# EAGLE design working (EAGLE 7.6.0)
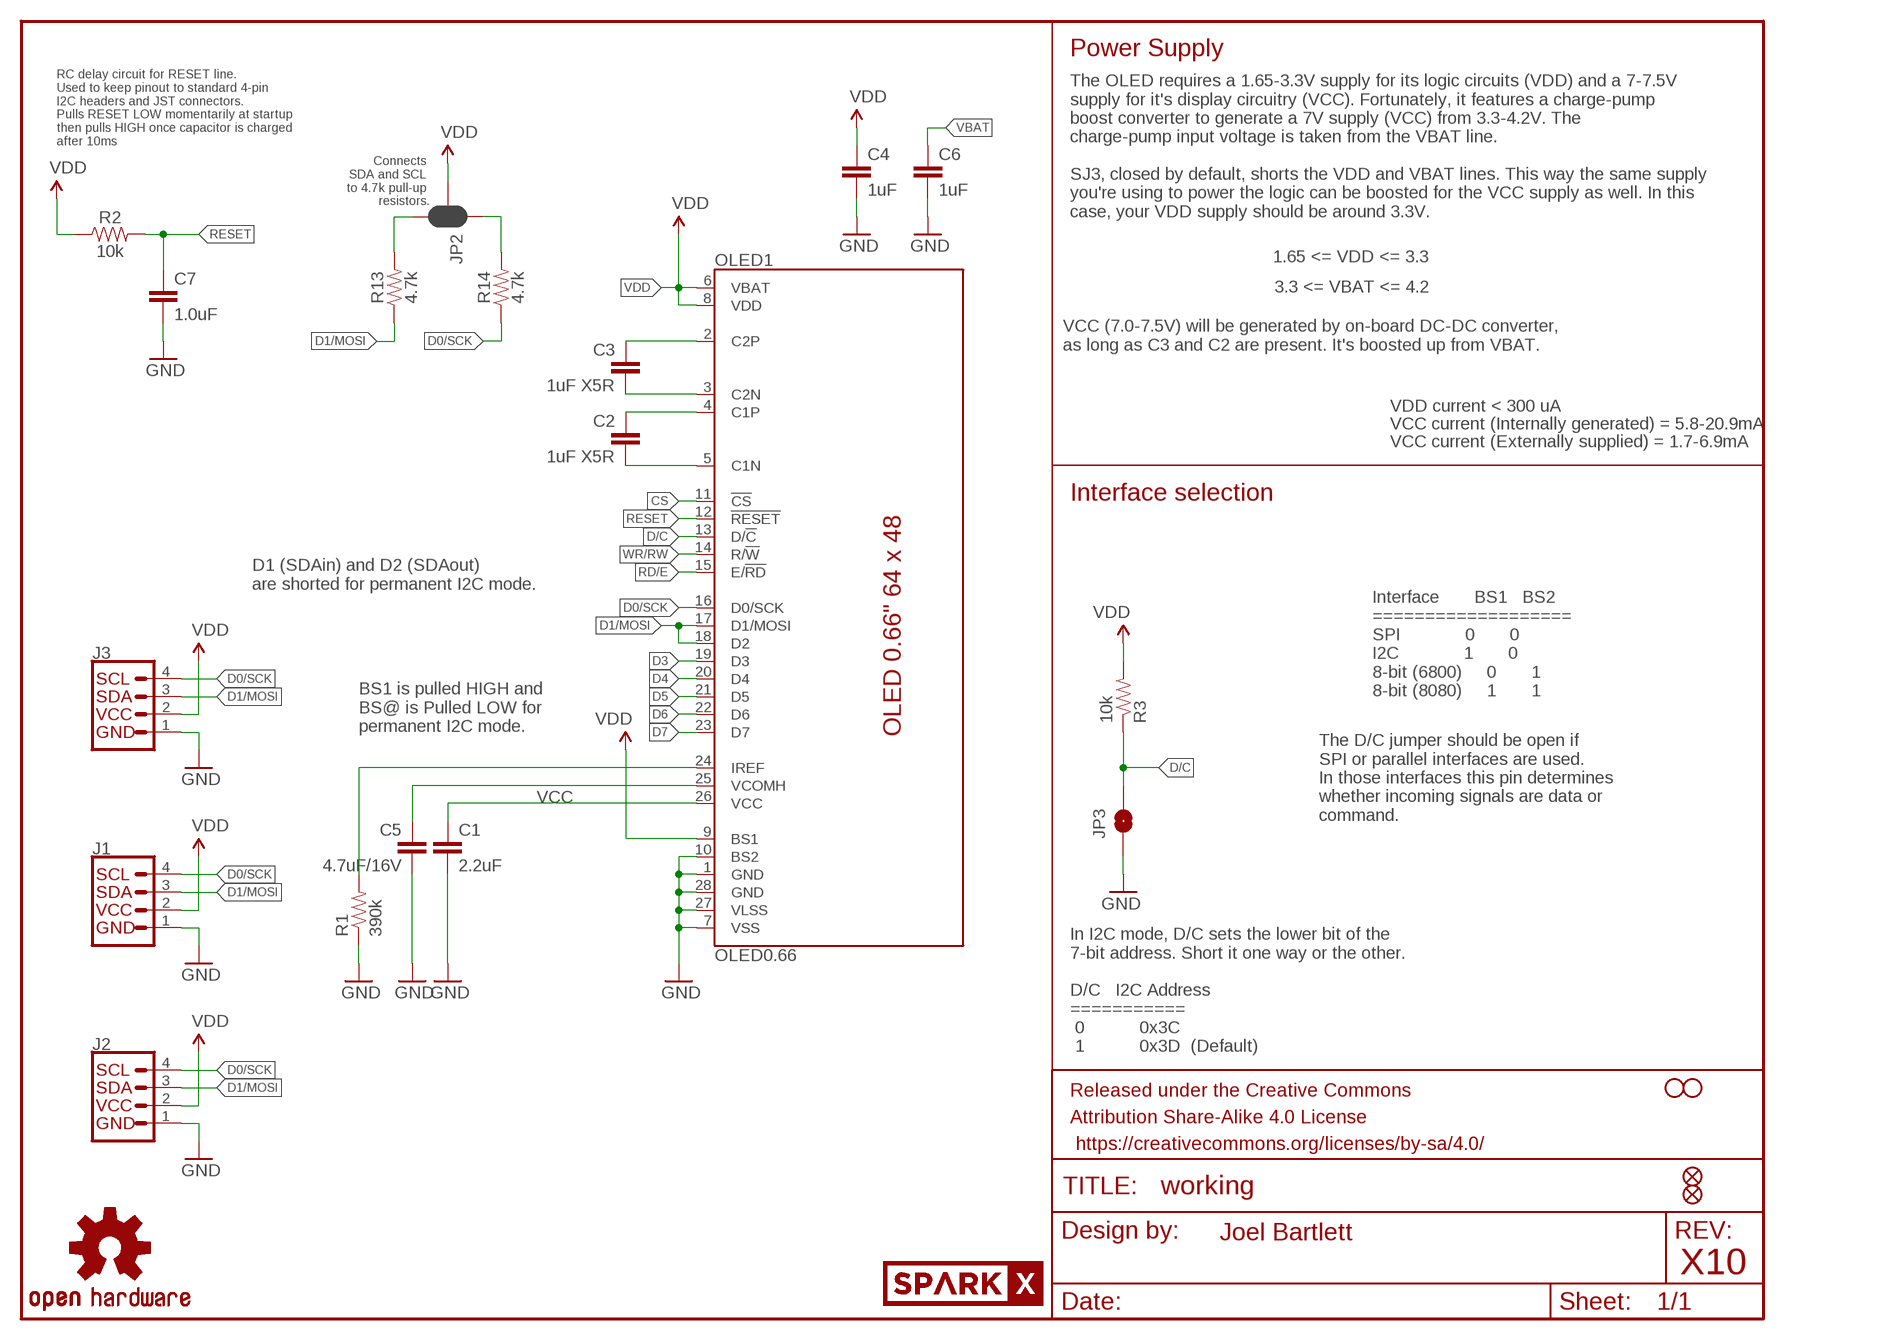
[diagram p0: schematic, sheet 1]

## Parts
C1  2.2uF  CAP0805  [0805]
C2  1uF X5R  CAP0805  [0805]
C3  1uF X5R  CAP0805  [0805]
C4  1uF  CAP0603-CAP  [0603-CAP]
C5  4.7uF/16V  CAP1206  [1206]
C6  1uF  CAP0603-CAP  [0603-CAP]
C7  1.0uF  1.0UF-0603-16V-10%  [0603]
FID1  FIDUCIAL1X2  [FIDUCIAL-1X2]
FID2  FIDUCIAL1X2  [FIDUCIAL-1X2]
FRAME1  FRAME-LETTER  [CREATIVE_COMMONS]
H1  STAND-OFF  [STAND-OFF]
H2  STAND-OFF  [STAND-OFF]
J1  I2C_STANDARDJS-1MM  [1X04_1MM_RA]
J2  I2C_STANDARDJS-1MM  [1X04_1MM_RA]
J3  I2C_STANDARD_NO_SILK  [1X04_NO_SILK]
JP2  JUMPER-SMT_3_2-NC_PASTE_SILK  [SMT-JUMPER_3_2-NC_PASTE_SILK]
JP3  JUMPER-SMT_2_NO_SILK  [SMT-JUMPER_2_NO_SILK]
LOGO3  OSHW-LOGOS  [OSHW-LOGO-S]
OLED1  OLED0.66  [OLED-0.66-64X48]
R1  390k  RESISTOR0603-RES  [0603-RES]
R2  10k  10KOHM-0603-1/10W-1%  [0603]
R3  10k  RESISTOR0603-RES  [0603-RES]
R13  4.7k  4.7KOHM-0603-1/10W-1%  [0603]
R14  4.7k  4.7KOHM-0603-1/10W-1%  [0603]
U$1  SPARKX-LOGO4  [SPARKX-MEDIUM]
U$3  SPARKX-LOGO2  [SPARKX-TINY]

## Nets
C1N: C2.2 OLED1.5(C1N)
C1P: C2.1 OLED1.4(C1P)
C2N: C3.2 OLED1.3(C2N)
C2P: C3.1 OLED1.2(C2P)
CS: OLED1.11(!CS!)
D0/SCK: J1.4(SCL) J2.4(SCL) J3.4(SCL) OLED1.16(D0/SCK) R14.1
D1/MOSI: J1.3(SDA) J2.3(SDA) J3.3(SDA) OLED1.17(D1/MOSI) OLED1.18(D2) R13.1
D3: OLED1.19(D3)
D4: OLED1.20(D4)
D5: OLED1.21(D5)
D6: OLED1.22(D6)
D7: OLED1.23(D7)
D/C: JP3.2 OLED1.13(D/!C!) R3.1
GND: C1.2 C4.2 C5.2 C6.2 C7.2 J1.1(GND) J2.1(GND) J3.1(GND) JP3.1 OLED1.1(GND) OLED1.7(VSS) OLED1.10(BS2) OLED1.27(VLSS) OLED1.28(GND) R1.1
IREF: OLED1.24(IREF) R1.2
N$4: JP2.3 R13.2
N$5: JP2.1 R14.2
RD/E: OLED1.15(E/!RD!)
RESET: C7.1 OLED1.12(!RESET!) R2.2
VBAT: C6.1
VCC: C1.1 OLED1.26(VCC)
VCOMH: C5.1 OLED1.25(VCOMH)
VDD: C4.1 J1.2(VCC) J2.2(VCC) J3.2(VCC) JP2.2 OLED1.6(VBAT) OLED1.8(VDD) OLED1.9(BS1) R2.1 R3.2
WR/RW: OLED1.14(R/!W!)

## Notes on the sheet
- Power Supply
- The OLED requires a 1.65-3.3V supply for its logic circuits (VDD) and a 7-7.5V
  supply for it's display circuitry (VCC). Fortunately, it features a charge-pump 
  boost converter to generate a 7V supply (VCC) from 3.3-4.2V. The 
  charge-pump input voltage is taken from the VBAT line.
  
  SJ3, closed by default, shorts the VDD and VBAT lines. This way the same supply 
  you're using to power the logic can be boosted for the VCC supply as well. In this 
  case, your VDD supply should be around 3.3V.
- RC delay circuit for RESET line. 
  Used to keep pinout to standard 4-pin
  I2C headers and JST connectors. 
  Pulls RESET LOW momentarily at startup
  then pulls HIGH once capacitor is charged
  after 10ms
- Connects 
  SDA and SCL 
  to 4.7k pull-up 
  resistors.
- 1.65 <= VDD <= 3.3
- 3.3 <= VBAT <= 4.2
- VCC (7.0-7.5V) will be generated by on-board DC-DC converter, 
  as long as C3 and C2 are present. It's boosted up from VBAT.
- VDD current < 300 uA
- VCC current (Internally generated) = 5.8-20.9mA
- VCC current (Externally supplied) = 1.7-6.9mA
- Interface selection
- D1 (SDAin) and D2 (SDAout)
  are shorted for permanent I2C mode.
- Interface       BS1   BS2
  ===================
  SPI             0       0
  I2C             1       0
  8-bit (6800)     0       1
  8-bit (8080)     1       1
- BS1 is pulled HIGH and 
  BS@ is Pulled LOW for 
  permanent I2C mode.
- The D/C jumper should be open if
  SPI or parallel interfaces are used.
  In those interfaces this pin determines
  whether incoming signals are data or
  command.
- In I2C mode, D/C sets the lower bit of the 
  7-bit address. Short it one way or the other.
  
  D/C   I2C Address
  ===========
   0           0x3C
   1           0x3D  (Default)
- Joel Bartlett
- X10

## Library data of the parts
C1-C6 = SparkFun-Passives:CAP: Capacitor Standard 0603 ceramic capacitor, and 0.1" leaded capacitor.
C7 = SparkFun-Capacitors:1.0UF: 1µF ceramic capacitors A capacitor is a passive two-terminal electrical component used to store electrical energy temporarily in an electric field.; PROD_ID: CAP-00868
FID1 FID2 = SparkFun-Aesthetics:FIDUCIAL: Fiducial Alignment Points Various fiducial points for machine vision alignment.
FRAME1 = SparkFun-Aesthetics:FRAME-LETTER: Schematic Frame Standard 8.5x11 US Letter frame
H1 H2 = SparkFun-Hardware:STAND-OFF: Stand Off Drill holes for mechanically mounting via screws, standoffs, etc. Note: Use the keepout ring to avoid running the screw head into surrounding components. Variant Overviews STAND-OFF - Mechanical footprint for a #4 phillips button head screw. STAND-OFF-TIGHT - Mechanical footprint for a #4 phillips button head screw, Example SparkFun Products Screw - Phillips Head (1/4", 4-40, 10 pack) <https://www.sparkfun.com/products/10453> (PRT-10453) Screw - Phillips Head (1/2", 4-40, 10 pack) <https://www.sparkfun.com/products/10452> (PRT-10452) Screw - Phillips Head (3/4", 4-40, 10 pack) <https://www.sparkfun.com/products/10451> (PRT-10451) Screw - Phillips Head (1", 4-40, 10 pack) <https://www.sparkfun.com/products/10450> (PRT-10450)
J1-J3 = SparkX:I2C_STANDARD: SparkFun I2C Standard Pinout Header SparkFun has standardized on a pinout for all I2C based sensor breakouts. This pinout allows I2C boards to be plugged directly into the headers on Arduino Uno compatible boards, and to be daisy chained easily. Example SparkFun Products: SparkFun Atmospheric Sensor Breakout - BME280 <https://www.sparkfun.com/products/13676> SparkFun Altitude/Pressure Sensor Breakout - MPL3115A2 <https://www.sparkfun.com/products/11084> SparkFun TOF Range Finder Sensor - VL6180 <https://www.sparkfun.com/products/12785>
JP2 = SparkFun-Jumpers:JUMPER-SMT_3_2-NC_PASTE: Normally closed solder jumper (2 of 2 connections) This jumper has an aperture in the stencil to allow solder paste to bridge both connections. Both connections are normally closed (NC). Wick off the solder to open the connection(s). Reapply solder to reclose the connection(s).
JP3 = SparkFun-Jumpers:JUMPER-SMT_2_NO: Normally open jumper This jumper has two pads in close proximity to each other. Apply solder to close the connection. Round pads are easier to solder for beginners, but are a lot larger. SparkFun Product that uses the round pads: SparkFun EL Sequencer <https://www.sparkfun.com/products/12781>
LOGO3 = SparkFun-Aesthetics:OSHW-LOGO: Open Source Hardware Logo This logo indicates the piece of hardware it is found on incorporates a OSHW license and/or adheres to the definition of open source hardware found here: http://freedomdefined.org/OSHW
OLED1 = microView-temp:OLED0.66
R1 R3 = SparkFun-Passives:RESISTOR: Resistor Basic schematic elements and footprints for 0603, 1206, and PTH resistors.
R2 = SparkFun-Resistors:10KOHM: 10kΩ resistor A resistor is a passive two-terminal electrical component that implements electrical resistance as a circuit element. Resistors act to reduce current flow, and, at the same time, act to lower voltage levels within circuits. - Wikipedia; PROD_ID: RES-00824
R13 R14 = SparkFun-Resistors:4.7KOHM: 4.7kΩ resistor A resistor is a passive two-terminal electrical component that implements electrical resistance as a circuit element. Resistors act to reduce current flow, and, at the same time, act to lower voltage levels within circuits. - Wikipedia; PROD_ID: RES-07857
U$1 U$3 = SparkX:SPARKX-LOGO

## Board
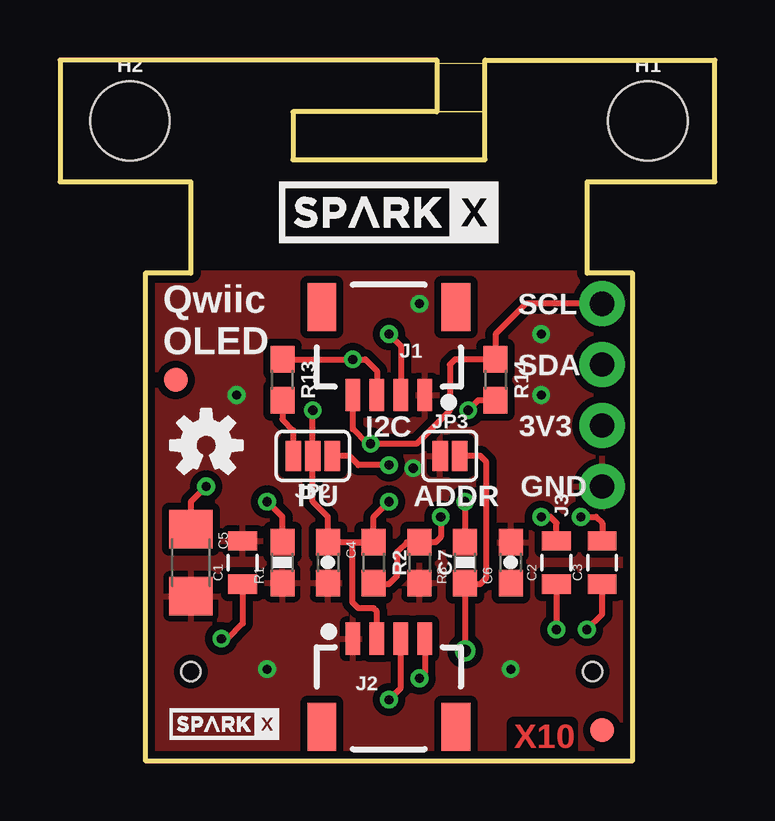
[diagram p1: board, top side]
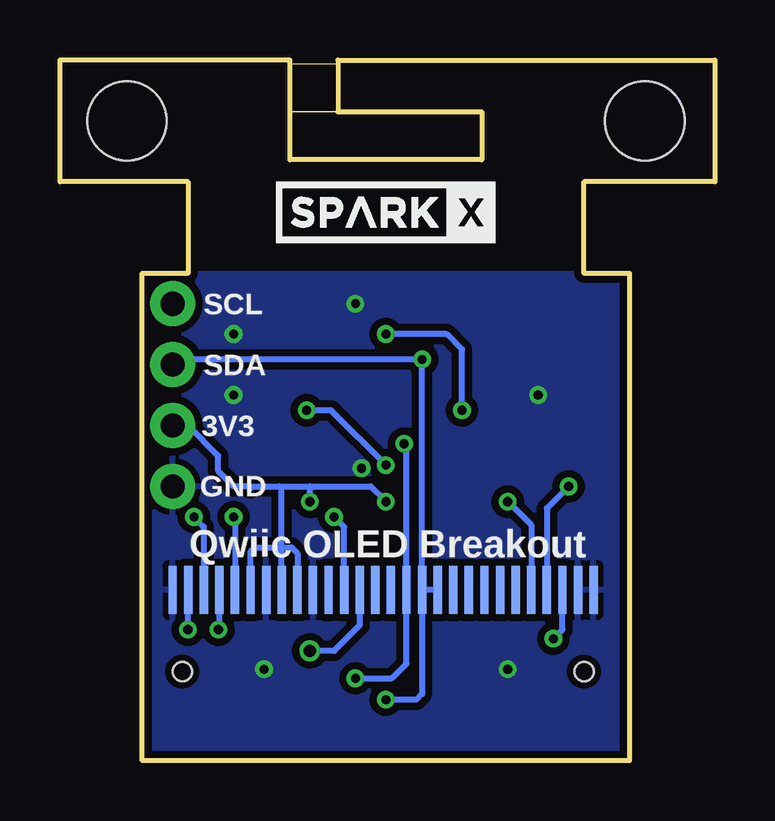
[diagram p2: board, bottom side, seen from below]

Size 27.3 x 29.21 mm. Coordinates in mm from the lower left corner, seen from the top.
Outline: 17.72,25.05 9.72,25.05 9.72,27.05 15.72,27.05 15.72,29.21 0,29.21 0,24.13 5.46,24.13 5.46,20.32 3.56,20.32 3.56,0 23.88,0 23.88,20.32 21.97,20.32 21.97,24.13 27.3,24.13 27.3,29.21 17.72,29.21 17.72,25.05
Copper layers (1*16): Top 0.035mm / dielectric 1.5mm / Bottom 0.035mm
Design rules "SparkFun-2-layer-TIGHT": minimum track width 7mil, minimum drill 15mil, track to track 7mil, track to pad 7mil, pad to pad 7mil, via to via 7mil, smd to smd 7mil, copper to edge 7mil, drill to drill 7mil, minimum pad ring 7mil, minimum via ring 7mil, stop-mask expansion 4mil, vias tented up to drill 25mil, thermal gap 10mil
Milling: area 9.7,25.1 to 17.7,27.1; area 15.7,27.1 to 17.7,29.1

### Footprints (pad centres in the part's own frame; a part is rotated, then mirrored left to right if it is on the bottom)
0805 = smd 0.8 x 1.2: 1 -0.9,0; 2 0.9,0
0603-CAP = smd 1.1 x 1: 1 -0.85,0; 2 0.85,0
1206 = smd 1.6 x 1.8: 1 -1.4,0; 2 1.4,0
0603 = smd 1.1 x 1: 1 -0.85,0; 2 0.85,0
FIDUCIAL-1X2 = smd 1 x 1: 1 0,0
STAND-OFF = hole 3.302: 0,0
1X04_1MM_RA = smd 0.6 x 1.35: 1 -1.5,0; 2 -0.5,0; 3 0.5,0; 4 1.5,0 | smd 1.2 x 2: NC1 2.8,-3.675; NC2 -2.8,-3.675
1X04_NO_SILK = drill 1.016 pad 1.88: 1 0,0; 2 2.54,0; 3 5.08,0; 4 7.62,0
SMT-JUMPER_3_2-NC_PASTE_SILK = smd 0.635 x 1.27: 1 -0.813,0; 2 0,0; 3 0.813,0
SMT-JUMPER_2_NO_SILK = smd 0.635 x 1.27: 1 -0.406,0; 2 0.406,0
OLED-0.66-64X48 = smd 0.35 x 2: 1 0,0; 2 0.65,0; 3 1.3,0; 4 1.95,0; 5 2.6,0; 6 3.25,0; 7 3.9,0; 8 4.55,0; 9 5.2,0; 10 5.85,0; 11 6.5,0; 12 7.15,0; 13 7.8,0; 14 8.45,0; 15 9.1,0; 16 9.75,0; 17 10.4,0; 18 11.05,0; 19 11.7,0; 20 12.35,0; 21 13,0; 22 13.65,0; 23 14.3,0; 24 14.95,0; 25 15.6,0; 26 16.25,0; 27 16.9,0; 28 17.55,0 | hole 0.8: 17.15,-3.4; 0.4,-3.4
0603-RES = smd 1.1 x 1: 1 -0.85,0; 2 0.85,0

### Placement (x,y rotation side)
C1  7.62,8.26 90 top
C2  20.7,8.26 90 top
C3  22.61,8.26 90 top
C4  11.18,8.26 270 top
C5  5.46,8.26 270 top
C6  18.8,8.26 90 top
C7  14.99,8.26 270 top
FID1  22.61,1.27 0 top
FID2  4.83,15.88 0 top
FRAME1  -14.22,-27.94 0 top  (outside the outline)
H1  24.51,26.67 0 top
H2  2.92,26.67 0 top
J1  13.72,15.24 180 top
J2  13.72,5.08 0 top
J3  22.61,11.43 90 top
JP2  10.54,12.7 180 top
JP3  16.26,12.7 0 top
LOGO3  6.1,13.14 0 top
OLED1  22.61,7.11 0 bottom
R1  9.27,8.26 90 top
R2  13.08,8.26 270 top
R3  16.89,8.26 90 top
R13  9.27,15.88 270 top
R14  18.16,15.88 270 top
U$1  13.72,22.86 0 top
U$2  SPARKX-LOGO4  [SPARKX-MEDIUM]  13.72,22.86 0 bottom
U$3  6.86,1.52 0 top

### Tracks (layer width: path | path; a pad name or v marks a point on that pad's centre or on a via)
C1N  (via drill 0.38)
  Top 0.254: C2.2 20.7,9.91 20.45,10.16 v20.07,10.16
  Bottom 0.254: v20.07,10.16 20.01,10.1 OLED1.5
C1P  (via drill 0.38)
  Top 0.254: C2.1 v20.7,5.46
  Bottom 0.254: v20.7,5.46 20.66,5.51 OLED1.4
C2N  (via drill 0.38)
  Top 0.254: 22.61,9.53 C3.2 22.61,9.91 22.35,10.16 v21.72,10.16
  Bottom 0.254: OLED1.3 21.31,9.75 v21.72,10.16
C2P  (via drill 0.38)
  Top 0.254: v21.97,5.46 22.61,6.1 C3.1
  Bottom 0.254: v21.97,5.46 21.96,5.48 OLED1.2
D0/SCK  (via drill 0.38)
  Top 0.254: J2.4 15.22,3.66 v14.99,3.43 | J3.4 19.43,19.05 18.16,17.78 R14.1 16.47,16.73 16.26,16.51 16.26,14.61 14.86,13.21 v12.95,13.21 12.83,13.21 12.22,13.82 J1.4
  Bottom 0.254: v14.99,3.43 13.46,3.43 12.86,4.04 OLED1.16 12.86,13.11 v12.95,13.21
D1/MOSI  (via drill 0.38)
  Top 0.254: v13.72,2.54 14.22,3.04 J2.3 | R13.1 v12.21,16.73 12.74,16.73 13.22,16.25 J1.3
  Bottom 0.254: OLED1.18 OLED1.17 | OLED1.17 12.21,2.78 12.45,2.54 v13.72,2.54 | OLED1.17 v12.21,16.73 22.39,16.73 J3.3
D/C  (via drill 0.51)
  Top 0.254: R3.1 16.93,7.37 | 16.93,7.37 17.53,7.37 17.78,7.62 17.78,12.45 17.53,12.7 JP3.2 | 16.93,7.37 16.89,7.33 v16.89,4.57
  Bottom 0.254: OLED1.13 14.81,5.64 15.88,4.57 v16.89,4.57
GND  (via drill 0.38)
  other vias: 8.64,3.81 14.73,12.19 20.07,15.24 14.99,19.05 20.07,17.78 18.8,3.81 7.37,15.24
  pour Bottom (isolate 0.305): 23.88,0 23.88,20.32 3.56,20.32 3.56,0
  pour Top (isolate 0.305): 23.88,0 23.88,20.32 3.56,20.32 3.56,0
IREF  (via drill 0.38)
  Top 0.254: R1.2 9.27,10.16 v8.64,10.79
  Bottom 0.254: v8.64,10.79 7.66,9.81 OLED1.24
N$4
  Top 0.254: R13.2 9.27,14.22 9.73,13.77 JP2.3
N$5  (via drill 0.38)
  Top 0.254: 17.95,15.03 R14.2 17.44,15.03 v17.02,14.61 | v13.72,12.32 12.45,12.32 12.07,12.7 JP2.1
  Bottom 0.254: v13.72,12.32 16,14.61 v17.02,14.61
RESET  (via drill 0.38)
  Top 0.254: R2.2 13.12,7.37 13.72,7.37 14.07,7.72 14.07,8.71 14.46,9.11 C7.1 15.66,9.11 15.88,9.32 v15.88,10.16
  Bottom 0.254: OLED1.12 15.46,9.74 v15.88,10.16
VCC  (via drill 0.38)
  Top 0.254: C1.1 7.62,5.71 6.98,5.08 v6.73,5.08
  Bottom 0.254: v6.73,5.08 6.36,5.46 OLED1.26
VCOMH  (via drill 0.38)
  Top 0.254: C5.1 5.46,10.79 v6.1,11.43
  Bottom 0.254: v6.1,11.43 7.01,10.52 OLED1.25
VDD  (via drill 0.38)
  Top 0.254: J2.2 13.22,6.21 13.08,6.35 12.45,6.35 12.19,6.6 12.19,9.11 R2.1 | R2.1 C4.1 11.18,10.16 10.54,10.79 JP2.2 v10.54,14.61 | v16.89,10.79 R3.2 | v13.72,17.78 14.22,17.28 J1.2 | R2.1 13.08,10.16 v13.72,10.79
  Bottom 0.254: 18.06,8.89 18.06,11.32 18.16,11.43 | v10.54,14.61 10.54,17.14 11.18,17.78 v13.72,17.78 | 16.89,11.43 v16.89,10.79 | 19.43,11.43 18.16,11.43 | 18.16,11.43 16.89,11.43 | 19.36,11.36 19.43,11.43 | J3.2 21.97,13.97 20.7,12.7 20.7,12.06 20.07,11.43 19.43,11.43 | 16.89,11.43 14.35,11.43 v13.72,10.79 | OLED1.8 18.06,8.89 | 18.06,8.89 17.65,8.89 17.41,8.64 OLED1.9 | OLED1.6 19.36,8.71 19.18,8.89 18.06,8.89

### Text on the board
Top: X10
tPlace: SCL | Qwiic / OLED | SDA | 3V3 | I2C | PU | ADDR | GND
bPlace: SCL | SDA | 3V3 | GND | Qwiic OLED Breakout
tDocu: Joel Bartlett